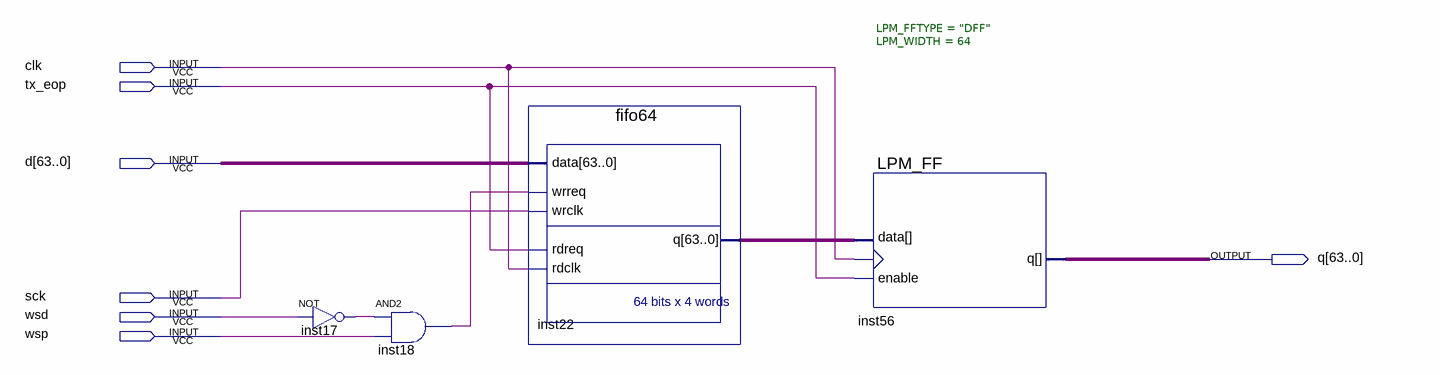
[diagram p0: schematic sheet]
// Quartus schematic txiqlatch.bdf as structural Verilog: 4 symbols, 7 pins
module txiqlatch (
  input  clk,
  input  tx_eop,
  input  [63:0] d,
  input  sck,
  input  wsd,
  input  wsp,
  output [63:0] q
);

  wire inst17_out, inst18_out;
  wire [63:0] inst22_q;

  not inst17 (inst17_out, wsd);
  and inst18 (inst18_out, inst17_out, wsp);
  fifo64 inst22 (.data(d), .wrreq(inst18_out), .wrclk(sck), .rdreq(tx_eop), .rdclk(clk), .q(inst22_q));
  LPM_FF #(.LPM_FFTYPE("DFF"), .LPM_WIDTH(64)) inst56 (.enable(tx_eop), .clock(clk), .data(inst22_q), .q(q));
endmodule
